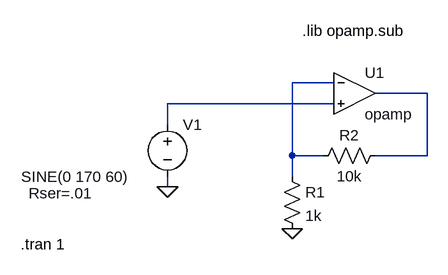
[diagram p0: schematic non_inverting_op_amp.asc]
non_inverting_op_amp.asc, the LTspice schematic file:
Version 4
SHEET 1 880 680
WIRE 128 128 64 128
WIRE 272 144 192 144
WIRE 128 160 -128 160
WIRE -128 192 -128 160
WIRE 64 240 64 128
WIRE 112 240 64 240
WIRE 272 240 272 144
WIRE 272 240 192 240
WIRE 64 272 64 240
WIRE -128 288 -128 272
FLAG -128 288 0
FLAG 64 352 0
SYMBOL OpAmps\\opamp 160 80 R0
SYMATTR InstName U1
SYMBOL voltage -128 176 R0
WINDOW 3 -225 96 Left 2
WINDOW 123 0 0 Left 0
WINDOW 39 -214 122 Left 2
SYMATTR InstName V1
SYMATTR Value SINE(0 170 60)
SYMATTR SpiceLine Rser=.01
SYMBOL res 48 256 R0
SYMATTR InstName R1
SYMATTR Value 1k
SYMBOL res 208 224 R90
WINDOW 0 0 56 VBottom 2
WINDOW 3 32 56 VTop 2
SYMATTR InstName R2
SYMATTR Value 10k
TEXT 80 48 Left 2 !.lib opamp.sub
TEXT -354 376 Left 2 !.tran 1

The netlist it stands for:
* non_inverting_op_amp.asc
XU1 N001 N003 N002 opamp Aol=100K GBW=10Meg  ; pins invin noninvin out
V1 N003 0 SINE(0 170 60) Rser=.01
R1 N001 0 1k
R2 N002 N001 10k
.lib opamp.sub
.tran 1
.backanno
.end